# EAGLE design e-stop-radio (EAGLE 9.5.1)

## Sheet 1 of 2
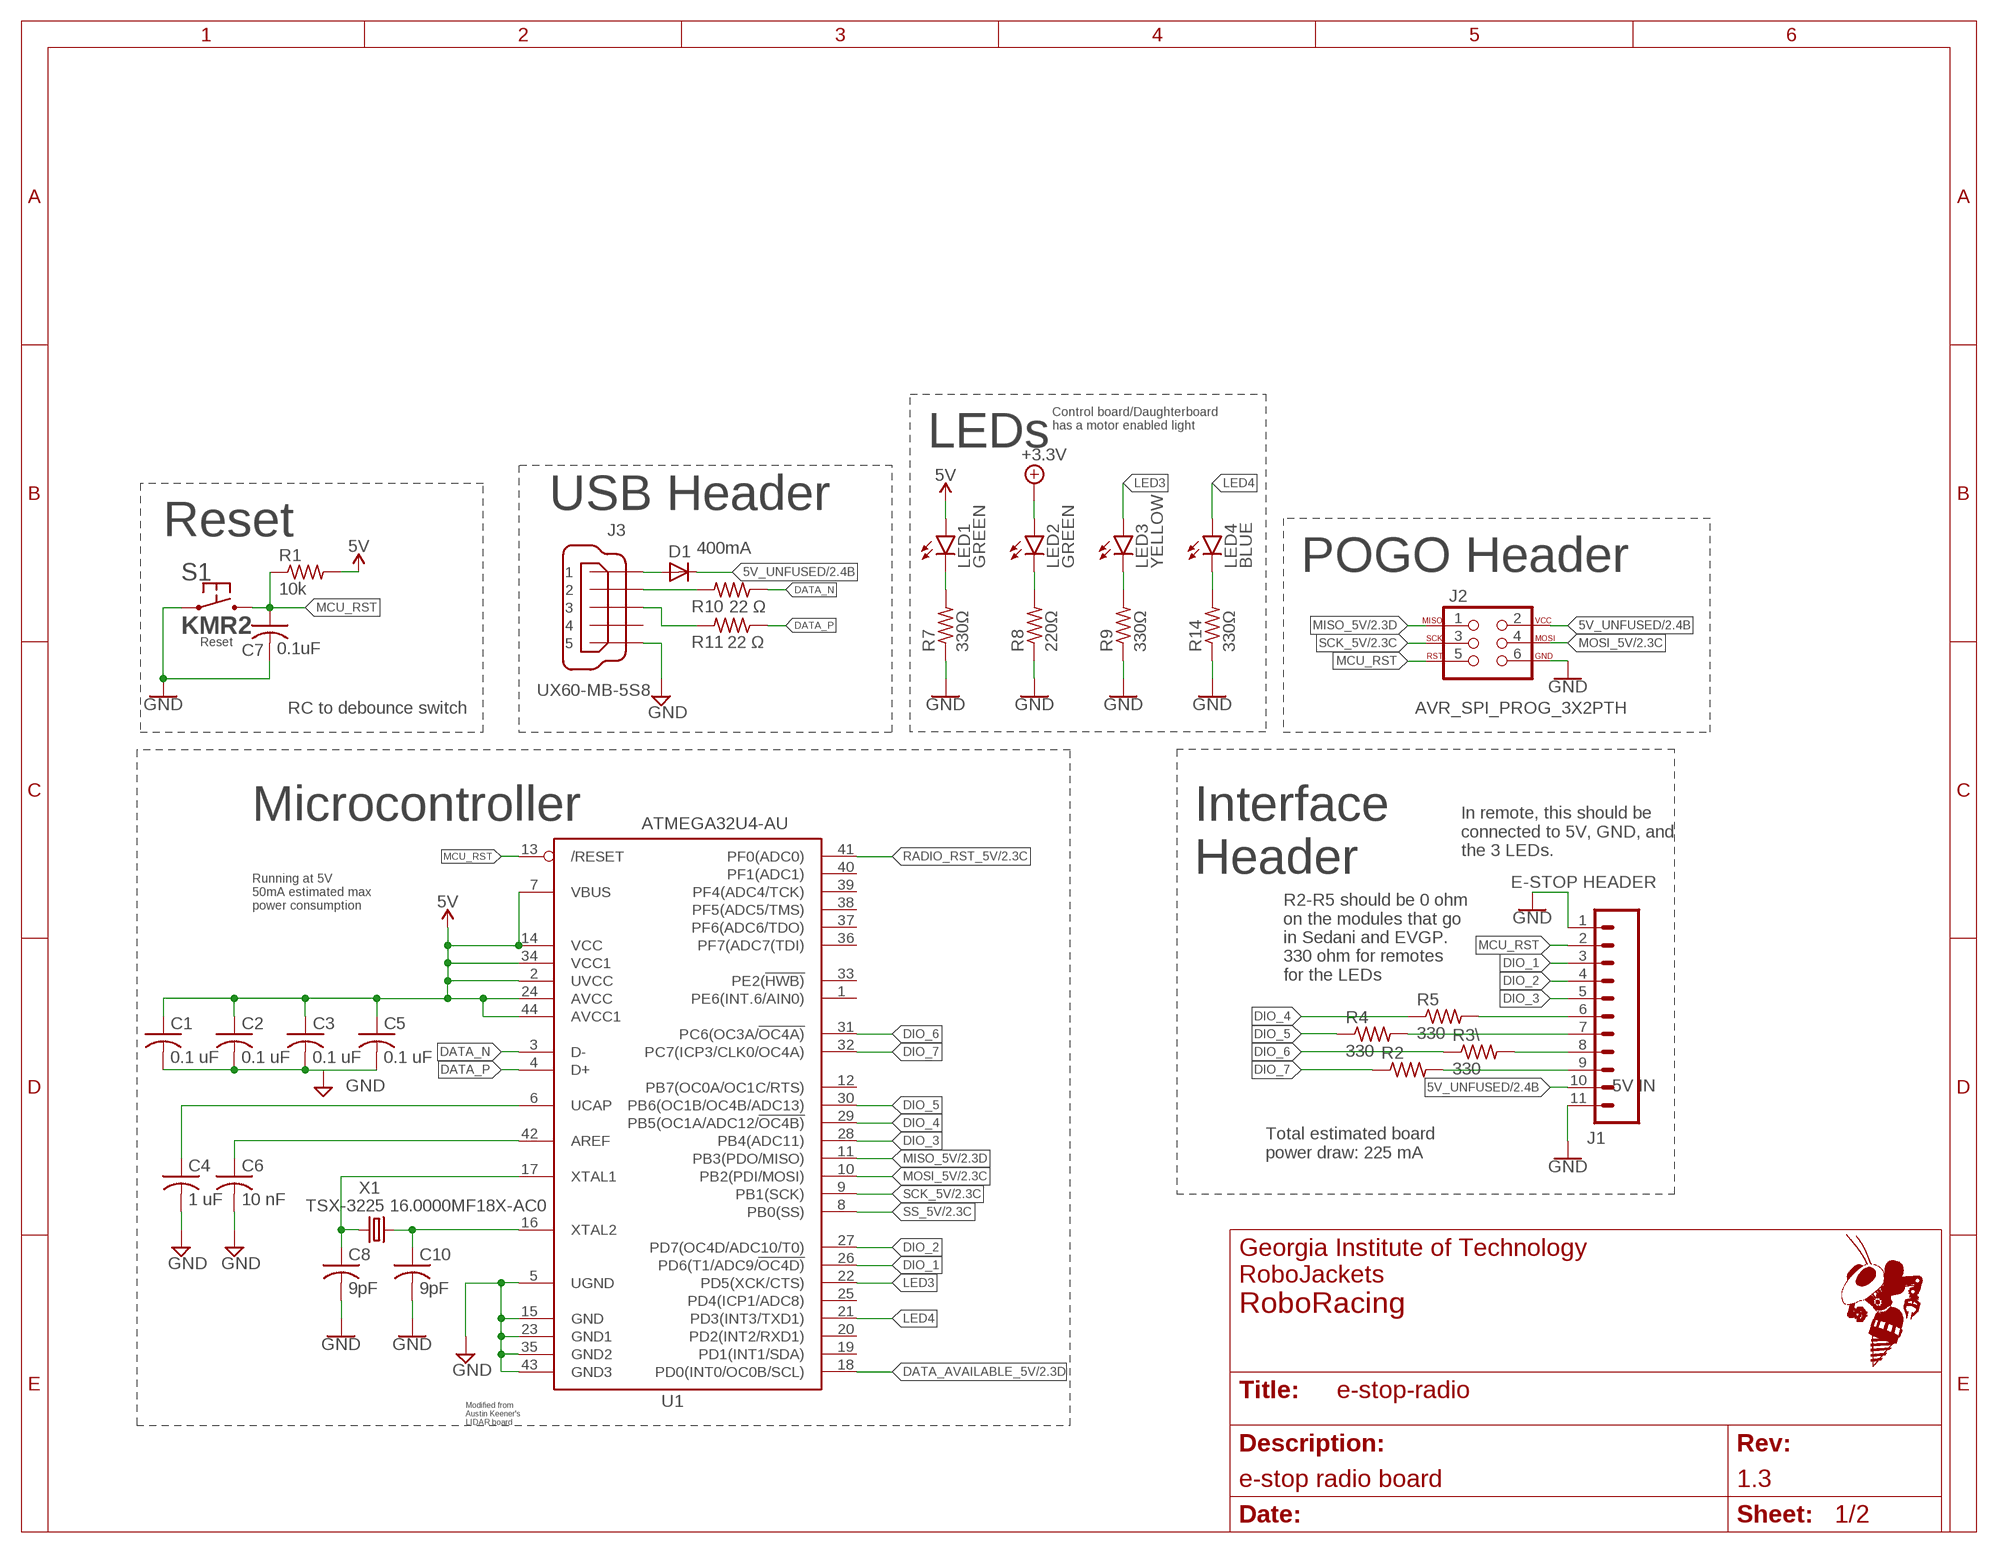
[diagram p0: schematic, sheet 1]
FRAME4 (FRAME_A_L): REVISION: 1.3; SCH_DESC: e-stop radio board; TEAM: RoboRacing

### Parts
C1  0.1 uF  C-USC0603  [C0603]
C2  0.1 uF  C-USC0603  [C0603]
C3  0.1 uF  C-USC0603  [C0603]
C4  1 uF  C-USC0603  [C0603]
C5  0.1 uF  C-USC0603  [C0603]
C6  10 nF  C-USC0603  [C0603]
C7  0.1uF  C-USC0603  [C0603]
C8  9pF  C-USC0603  [C0603]
C10  9pF  C-USC0603  [C0603]
D1  400mA  DIODE-SOD323-R  [SOD323-R]
J1  E-STOP HEADER  CONN_11  [1X11]
J2  AVR_SPI_PROG_3X2PTH  [2X3]
J3  UX60-MB-5S8  [UX60-MB-5S8]
LED1  GREEN  LEDCHIP-LED0603  [CHIP-LED0603]
LED2  GREEN  LEDCHIP-LED0603  [CHIP-LED0603]
LED3  YELLOW  LEDCHIP-LED0603  [CHIP-LED0603]
LED4  BLUE  LEDCHIP-LED0603  [CHIP-LED0603]
R1  10k  R-US_R0603  [R0603]
R2  330  R-US_R0603  [R0603]
R3\  330  R-US_R0603  [R0603]
R4  330  R-US_R0603  [R0603]
R5  330  R-US_R0603  [R0603]
R7  330Ω  R-US_R0603  [R0603]
R8  220Ω  R-US_R0603  [R0603]
R9  330Ω  R-US_R0603  [R0603]
R10  22 Ω  R-US_R0603  [R0603]
R11  22 Ω  R-US_R0603  [R0603]
R14  330Ω  R-US_R0603  [R0603]
S1  KMR2  [KMR2]
U1  ATMEGA32U4-AU  [TQFP44]
X1  TSX-3225 16.0000MF18X-AC0  XTAL-3.2X2.5  [XTAL-3.2X2.5]

### Nets
5V [power]: C1.1 C2.1 C3.1 C5.1 LED1.A R1.2 U1.2(UVCC) U1.7(VBUS) U1.14(VCC) U1.24(AVCC) U1.34(VCC1) U1.44(AVCC1) ; also sheet 2
5V_UNFUSED [power]: D1.C J1.10 J2.2 ; also sheet 2
+3.3V [power]: LED2.A ; also sheet 2
AREF: C6.1 U1.42(AREF)
DATA_AVAILABLE_5V: U1.18(PD0(INT0/OC0B/SCL)) ; also sheet 2
DATA_N [RF]: R10.1 U1.3(D-)
DATA_P [RF]: R11.1 U1.4(D+)
DIO_1: J1.3 U1.26(PD6(T1/ADC9/!OC4D))
DIO_2: J1.4 U1.27(PD7(OC4D/ADC10/T0))
DIO_3: J1.5 U1.28(PB4(ADC11))
DIO_4: R5.1 U1.29(PB5(OC1A/ADC12/!OC4B))
DIO_4_R: J1.6 R5.2
DIO_5: R4.1 U1.30(PB6(OC1B/OC4B/ADC13))
DIO_5_R: J1.7 R4.2
DIO_6: R3\.1 U1.31(PC6(OC3A/!OC4A))
DIO_6_R: J1.8 R3\.2
DIO_7: R2.1 U1.32(PC7(ICP3/CLK0/OC4A))
DIO_7_R: J1.9 R2.2
GND [power]: C1.2 C2.2 C3.2 C4.2 C5.2 C6.2 C7.2 C8.2 C10.2 J1.1 J1.11 J2.6 J3.5 R7.1 R8.1 R9.1 R14.1 S1.1.1 S1.1.2 U1.5(UGND) U1.15(GND) U1.23(GND1) U1.35(GND2) U1.43(GND3) ; also sheet 2
LED3: LED3.A U1.22(PD5(XCK/CTS))
LED4: LED4.A U1.21(PD3(INT3/TXD1))
MCU_RST: C7.1 J1.2 J2.5 R1.1 S1.2.1 S1.2.2 U1.13(/RESET)
MISO_5V: J2.1 U1.11(PB3(PDO/MISO)) ; also sheet 2
MOSI_5V: J2.4 U1.10(PB2(PDI/MOSI)) ; also sheet 2
N$2: LED3.C R9.2
N$3: LED1.C R7.2
N$4: LED2.C R8.2
N$5: J3.2 R10.2
N$6: LED4.C R14.2
N$7: D1.A J3.1
N$11: J3.3 R11.2
RADIO_RST_5V: U1.41(PF0(ADC0)) ; also sheet 2
SCK_5V: J2.3 U1.9(PB1(SCK)) ; also sheet 2
SS_5V: U1.8(PB0(SS)) ; also sheet 2
UCAP: C4.1 U1.6(UCAP)
XTAL1: C8.1 U1.17(XTAL1) X1.1
XTAL2: C10.1 U1.16(XTAL2) X1.3
Unconnected: J3.4 U1.1(PE6(INT.6/AIN0)) U1.12(PB7(OC0A/OC1C/RTS)) U1.19(PD1(INT1/SDA)) U1.20(PD2(INT2/RXD1)) U1.25(PD4(ICP1/ADC8)) U1.33(PE2(!HWB)) U1.36(PF7(ADC7(TDI)) U1.37(PF6(ADC6/TDO)) U1.38(PF5(ADC5/TMS)) U1.39(PF4(ADC4/TCK)) U1.40(PF1(ADC1))

### Notes on the sheet
- Control board/Daughterboard
  has a motor enabled light
- LEDs
- USB Header
- Reset
- POGO Header
- RC to debounce switch
- Microcontroller
- In remote, this should be 
  connected to 5V, GND, and 
  the 3 LEDs.
- Interface
  Header
- Running at 5V
  50mA estimated max
  power consumption
- R2-R5 should be 0 ohm
  on the modules that go
  in Sedani and EVGP.
  330 ohm for remotes
  for the LEDs
- 5V IN
- Total estimated board
  power draw: 225 mA
- Modified from 
  Austin Keener's 
  LIDAR board

## Sheet 2 of 2
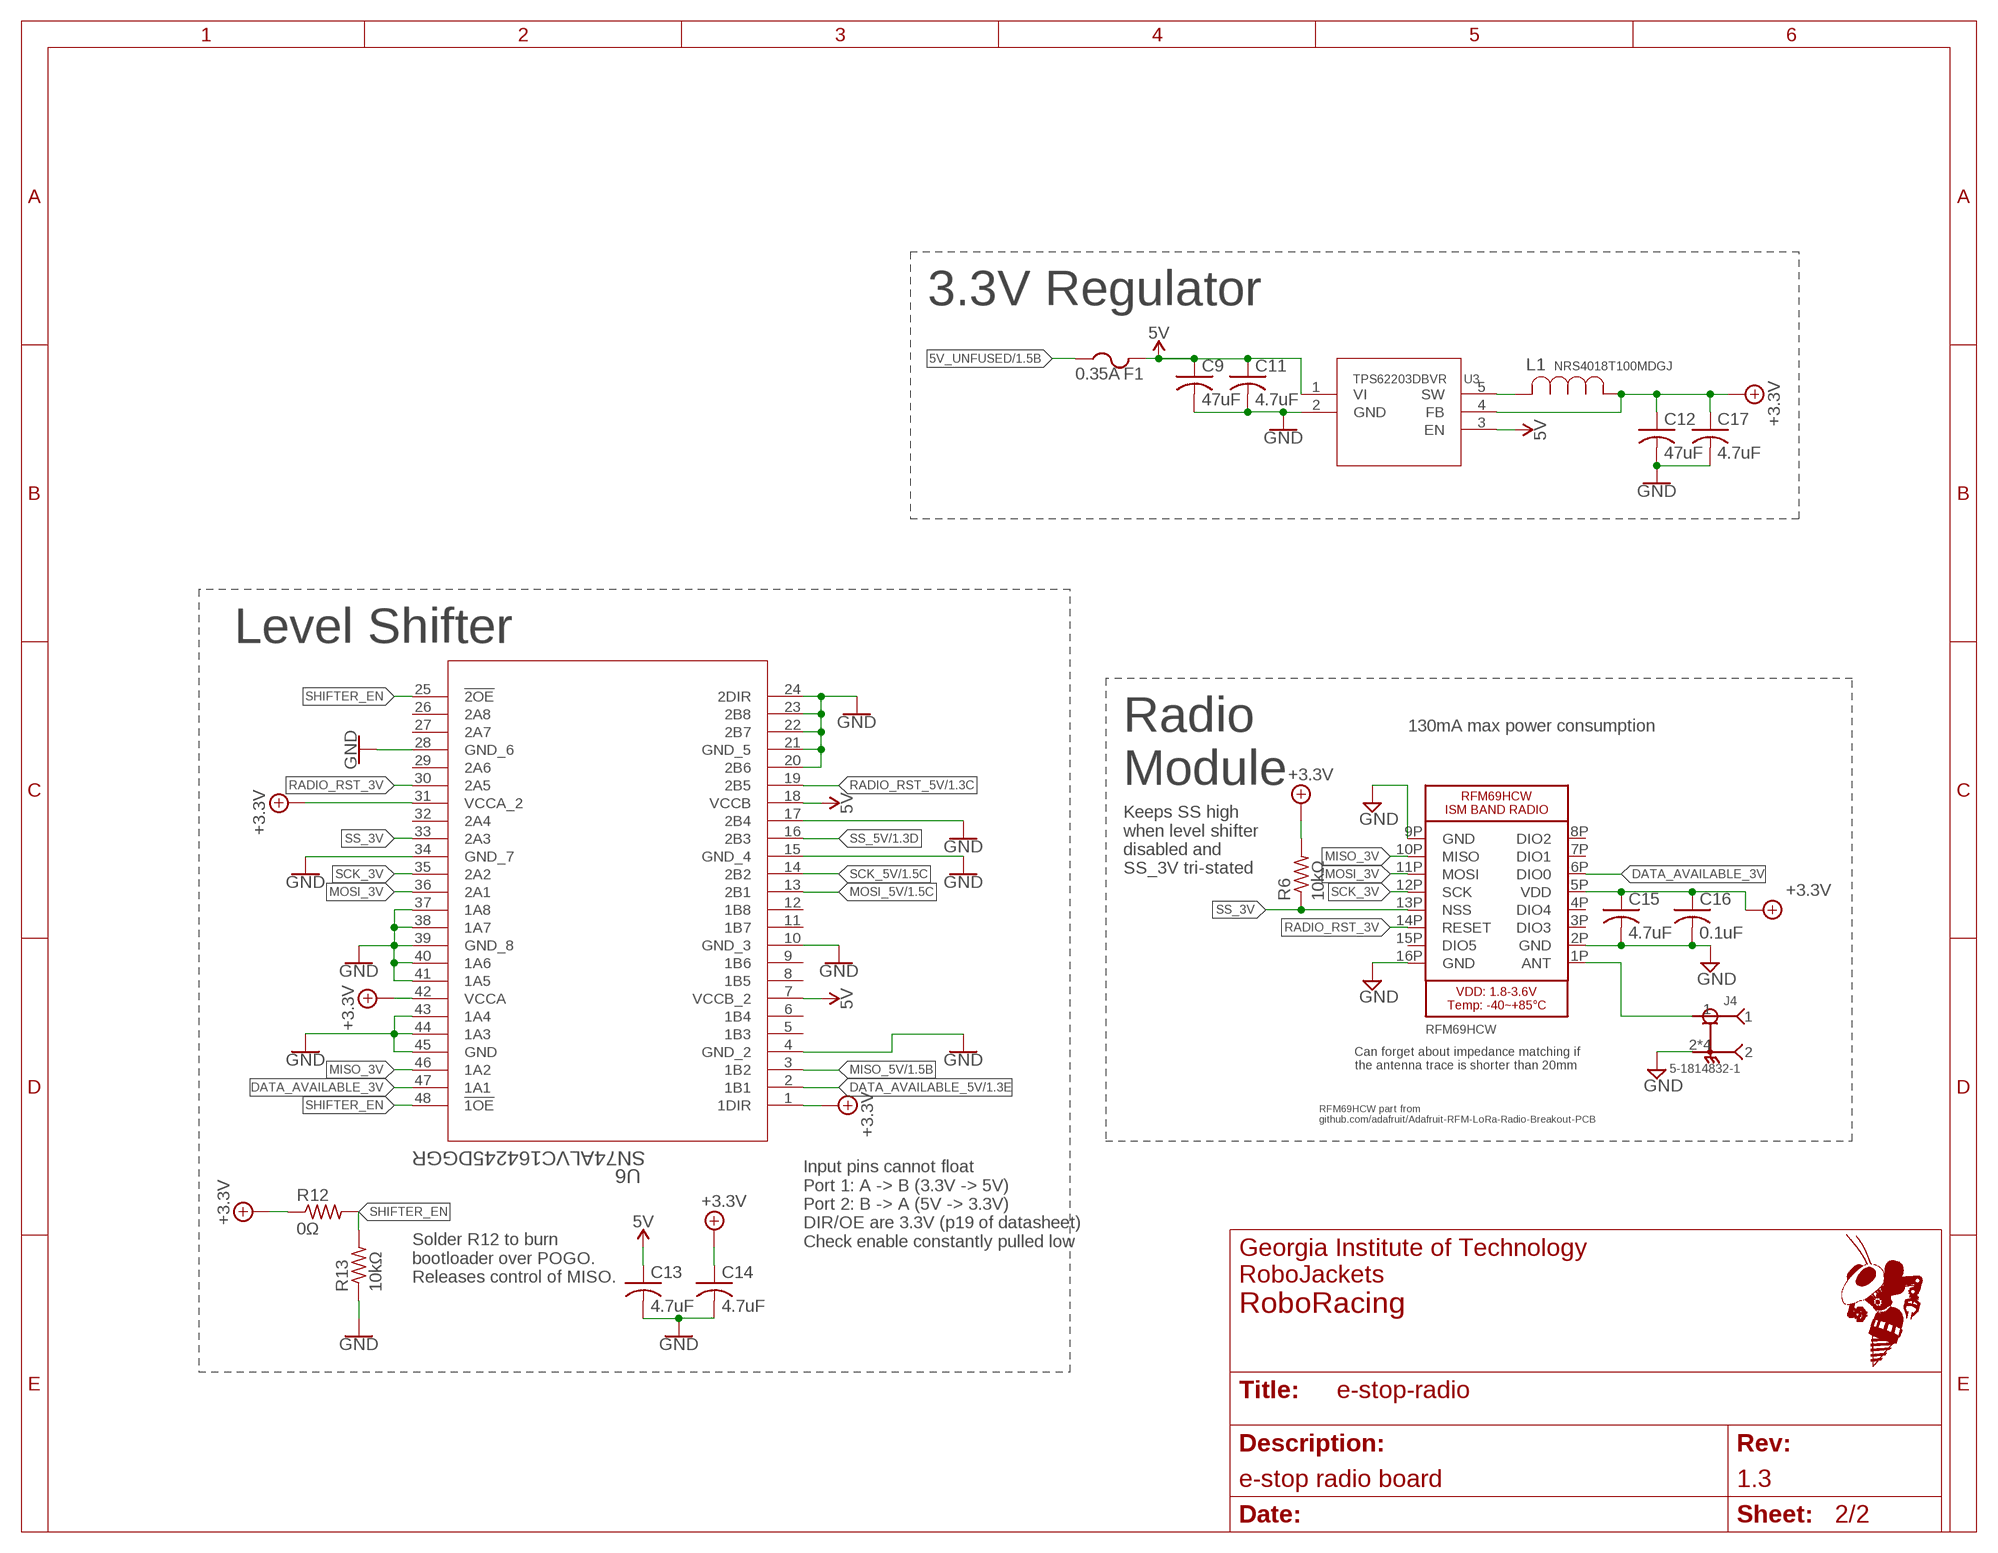
[diagram p1: schematic, sheet 2]
FRAME3 (FRAME_A_L): REVISION: 1.3; SCH_DESC: e-stop radio board; TEAM: RoboRacing

### Parts
C9  47uF  C-USC1206  [C1206]
C11  4.7uF  C-USC0603  [C0603]
C12  47uF  C-USC1206  [C1206]
C13  4.7uF  C-USC0603  [C0603]
C14  4.7uF  C-USC0603  [C0603]
C15  4.7uF  C-USC0603  [C0603]
C16  0.1uF  C-USC0603  [C0603]
C17  4.7uF  C-USC0603  [C0603]
F1  0.35A  PTCFUSE-1206  [R1206]
J4  5-1814832-1  [TE_5-1814832-1]
L1  NRS4018T100MDGJ  [IND_TAIYO_NRS4018]
R6  10kΩ  R-US_R0603  [R0603]
R12  0Ω  R-US_R0603  [R0603]
R13  10kΩ  R-US_R0603  [R0603]
U3  TPS62203DBVR  [DBV5]
U5  RFM69HCW  RFM69HCW_SMT  [RFMHCW_SMT]
U6  SN74ALVC164245DGGR  [DGG48]

### Nets
5V [power]: C9.1 C11.1 C13.1 F1.2 U3.1(VI) U3.3(EN) U6.7(VCCB_2) U6.18(VCCB) ; also sheet 1
5V_UNFUSED [power]: F1.1 ; also sheet 1
+3.3V [power]: C12.1 C14.1 C15.1 C16.1 C17.1 L1.1 R6.2 R12.1 U3.4(FB) U5.5P(VDD) U6.1(1DIR) U6.31(VCCA_2) U6.42(VCCA) ; also sheet 1
DATA_AVAILABLE_3V: U5.6P(DIO0) U6.47(1A1)
DATA_AVAILABLE_5V: U6.2(1B1) ; also sheet 1
GND [power]: C9.2 C11.2 C12.2 C13.2 C14.2 C15.2 C16.2 C17.2 J4.2 J4.3 J4.4 J4.5 R13.1 U3.2(GND) U5.2P(GND) U5.9P(GND) U5.16P(GND) U6.4(GND_2) U6.10(GND_3) U6.15(GND_4) U6.17(2B4) U6.20(2B6) U6.21(GND_5) U6.22(2B7) U6.23(2B8) U6.24(2DIR) U6.28(GND_6) U6.34(GND_7) U6.37(1A8) U6.38(1A7) U6.39(GND_8) U6.40(1A6) U6.41(1A5) U6.43(1A4) U6.44(1A3) U6.45(GND) ; also sheet 1
MISO_3V: U5.10P(MISO) U6.46(1A2)
MISO_5V: U6.3(1B2) ; also sheet 1
MOSI_3V: U5.11P(MOSI) U6.36(2A1)
MOSI_5V: U6.13(2B1) ; also sheet 1
N$1 [power]: L1.2 U3.5(SW)
RADIO_RST_3V: U5.14P(RESET) U6.30(2A5)
RADIO_RST_5V: U6.19(2B5) ; also sheet 1
RF_SIGNAL [RF]: J4.1 U5.1P(ANT)
SCK_3V: U5.12P(SCK) U6.35(2A2)
SCK_5V: U6.14(2B2) ; also sheet 1
SHIFTER_EN: R12.2 R13.2 U6.25(!2OE) U6.48(!1OE)
SS_3V: R6.1 U5.13P(NSS) U6.33(2A3)
SS_5V: U6.16(2B3) ; also sheet 1
Unconnected: U5.3P(DIO3) U5.4P(DIO4) U5.7P(DIO1) U5.8P(DIO2) U5.15P(DIO5) U6.5(1B3) U6.6(1B4) U6.8(1B5) U6.9(1B6) U6.11(1B7) U6.12(1B8) U6.26(2A8) U6.27(2A7) U6.29(2A6) U6.32(2A4)

### Notes on the sheet
- 3.3V Regulator
- Level Shifter
- 130mA max power consumption
- Radio
  Module
- Keeps SS high
  when level shifter
  disabled and
  SS_3V tri-stated
- Can forget about impedance matching if 
  the antenna trace is shorter than 20mm
- RFM69HCW part from
  github.com/adafruit/Adafruit-RFM-LoRa-Radio-Breakout-PCB
- Input pins cannot float
  Port 1: A -> B (3.3V -> 5V)
  Port 2: B -> A (5V -> 3.3V)
  DIR/OE are 3.3V (p19 of datasheet)
  Check enable constantly pulled low
- Solder R12 to burn
  bootloader over POGO.
  Releases control of MISO.

## Library data of the parts
C1-C6 C8 C10 = resistor:C-US: CAPACITOR, American symbol
C7 C9 C11-C17 = rcl:C-US: CAPACITOR, American symbol; SPICEPREFIX: C
D1 = RoboJackets-Diodes:DIODE-: DIODE
F1 = adafruit:PTCFUSE: PTC fuses, resettable thermistors
J1 = SparkFun-Connectors:CONN_11: Multi connection point. Often used as Generic Header-pin footprint for 0.1 inch spaced/style header connections On any of the 0.1 inch spaced packages, you can populate with these: Break Away Headers - Straight <https://www.sparkfun.com/products/116> (PRT-00116) Break Away Male Headers - Right Angle <https://www.sparkfun.com/products/553> (PRT-00553) Female Headers <https://www.sparkfun.com/products/115> (PRT-00115) Break Away Headers - Machine Pin <https://www.sparkfun.com/products/117> (PRT-00117) Break Away Female Headers - Swiss Machine Pin <https://www.sparkfun.com/products/743> (PRT-00743) For SCREWTERMINALS and SPRING TERMINALS visit here: Screw Terimnals on SparkFun.com <https://www.sparkfun.com/search/results?term=Screw+Terminals> (5mm/3.5mm/2.54mm spacing) This device is also useful as a general connection point to wire up your design to another part of your project. Our various solder wires solder well into these plated through hole pads. Hook-Up Wire - Assortment (Stranded, 22 AWG) <https://www.sparkfun.com/products/11375> (PRT-11375) Hook-Up Wire - Assortment (Solid Core, 22 AWG) <https://www.sparkfun.com/products/11367> (PRT-11367) View the entire wire category on our website here <https://www.sparkfun.com/categories/141>
J2 = SparkFun-Connectors:AVR_SPI_PROG_3X2: AVR ISP 6 Pin This is the reduced ISP connector for AVR programming. Common on Arduino. This footprint will take up less PCB space and can be used with a 10-pin to 6-pin adapter such as SKU: BOB-08508 **Special note about "TEST_POINT" package. The stop mask is on the top side, so if you want your programming test points to be on the bottom of your board, make sure to place this package on the bottom side of the board. This also ensure that the orientation to program from the bottom side will be correct. SparkFun Products: SparkFun ISP Pogo Adapter <https://www.sparkfun.com/products/11591> - NS Tiny AVR Programmer <https://www.sparkfun.com/products/11801> -PTH
J3 = RoboJackets-Connectors:UX60*-MB-5S?: Mini USB Connector Brand: Hirose Electric Co Ltd <http://www.hirose.com/us/> Series: UX <http://www.digikey.com/product-search/en?FV=fff40016,fff802e4,ffec3225> Distributor: Digi-Key <http://www.digikey.com/product-detail/en/UX60A-MB-5ST/H2961CT-ND/597540>; PINS: 5
J4 = estop-v1.0:5-1814832-1: SMA Str PCB Skt GZD; COMMENT: 5-1814832-1; DESCRIPTION: SMA Str PCB Skt GZD; DIGI-KEY_PART_NUMBER: A97594-ND; DIGI-KEY_PURCHASE_URL: https://www.digikey.com/product-detail/en/te-connectivity-amp-connectors/5-1814832-1/A97594-ND/1755982?utm_source=snapeda&utm_medium=aggregator&utm_campaign=symbol; EU_ROHS_COMPLIANCE: Compliant with Exemptions; MF: TE Connectivity; MP: 5-1814832-1; NUMBER_OF_POSITIONS: 1; PACKAGE: None; TE_PURCHASE_URL: https://www.te.com/usa-en/product-5-1814832-1.html?te_bu=Cor&te_type=disp&te_campaign=seda_glo_cor-seda-global-disp-prtnr-fy19-seda-model-bom-cta_sma-317_1&elqCampaignId=32493
L1 = estop-v1.0:NRS4018T100MDGJ; MANUFACTURER_PART_NUMBER: NRS4018T100MDGJ; VENDOR: TAIYO YUDEN
LED1-LED4 = led:LED: LED OSRAM: - CHIPLED LG R971, LG N971, LY N971, LG Q971, LY Q971, LO R971, LY R971 LH N974, LH R974 LS Q976, LO Q976, LY Q976 LO Q996 - Hyper CHIPLED LW Q18S LB Q993, LB Q99A, LB R99A - SideLED LS A670, LO A670, LY A670, LG A670, LP A670 LB A673, LV A673, LT A673, LW A673 LH A674 LY A675 LS A676, LA A676, LO A676, LY A676, LW A676 LS A679, LY A679, LG A679 - Hyper Micro SIDELED® LS Y876, LA Y876, LO Y876, LY Y876 LT Y87S - SmartLED LW L88C, LW L88S LB L89C, LB L89S, LG L890 LS L89K, LO L89K, LY L89K LS L896, LA L896, LO L896, LY L896 - TOPLED LS T670, LO T670, LY T670, LG T670, LP T670 LSG T670, LSP T670, LSY T670, LOP T670, LYG T670 LG T671, LOG T671, LSG T671 LB T673, LV T673, LT T673, LW T673 LH T674 LS T676, LA T676, LO T676, LY T676, LB T676, LH T676, LSB T676, LW T676 LB T67C, LV T67C, LT T67C, LS T67K, LO T67K, LY T67K, LW E67C LS E67B, LA E67B, LO E67B, LY E67B, LB E67C, LV E67C, LT E67C LW T67C LS T679, LY T679, LG T679 LS T770, LO T770, LY T770, LG T770, LP T770 LB T773, LV T773, LT T773, LW T773 LH T774 LS E675, LA E675, LY E675, LS T675 LS T776, LA T776, LO T776, LY T776, LB T776 LHGB T686 LT T68C, LB T68C - Hyper Mini TOPLED® LB M676 - Mini TOPLED Santana® LG M470 LS M47K, LO M47K, LY M47K Source: http://www.osram.convergy.de LUXEON: - LUMILED® LXK2-PW12-R00, LXK2-PW12-S00, LXK2-PW14-U00, LXK2-PW14-V00 LXK2-PM12-R00, LXK2-PM12-S00, LXK2-PM14-U00 LXK2-PE12-Q00, LXK2-PE12-R00, LXK2-PE12-S00, LXK2-PE14-T00, LXK2-PE14-U00 LXK2-PB12-K00, LXK2-PB12-L00, LXK2-PB12-M00, LXK2-PB14-N00, LXK2-PB14-P00, LXK2-PB14-Q00 LXK2-PR12-L00, LXK2-PR12-M00, LXK2-PR14-Q00, LXK2-PR14-R00 LXK2-PD12-Q00, LXK2-PD12-R00, LXK2-PD12-S00 LXK2-PH12-R00, LXK2-PH12-S00 LXK2-PL12-P00, LXK2-PL12-Q00, LXK2-PL12-R00 Source: www.luxeon.com KINGBRIGHT: KA-3528ASYC Source: www.kingbright.com
R1 R2 R3\ R4-R14 = rcl:R-US_: RESISTOR, American symbol; SPICEPREFIX: R
S1 = RoboJackets-Switches:KMR2; FUNCTION: Reset
U1 = estop-v1.0:ATMEGA32U4: http://www.ladyada.net/library/eagle
U3 = estop-v1.0:TPS62203DBVR; MANUFACTURER_PART_NUMBER: TPS62203DBVR; VENDOR: Texas Instruments
U5 = estop-v1.0:RFM69HCW: RFM69HCW - ISM Band RF Transceiver
U6 = estop-v1.0:SN74ALVC164245DGGR; MANUFACTURER_PART_NUMBER: SN74ALVC164245DGGR; VENDOR: Texas Instruments
X1 = RoboJackets-FreqGen:XTAL

## Net classes
0 default: width 0.203 mm, drill 0.508 mm, clearance 0.178 mm
1 power: width 0.305 mm, drill 0.508 mm, clearance 0.178 mm
2 RF: width 0.203 mm, clearance 0.178 mm

## Board
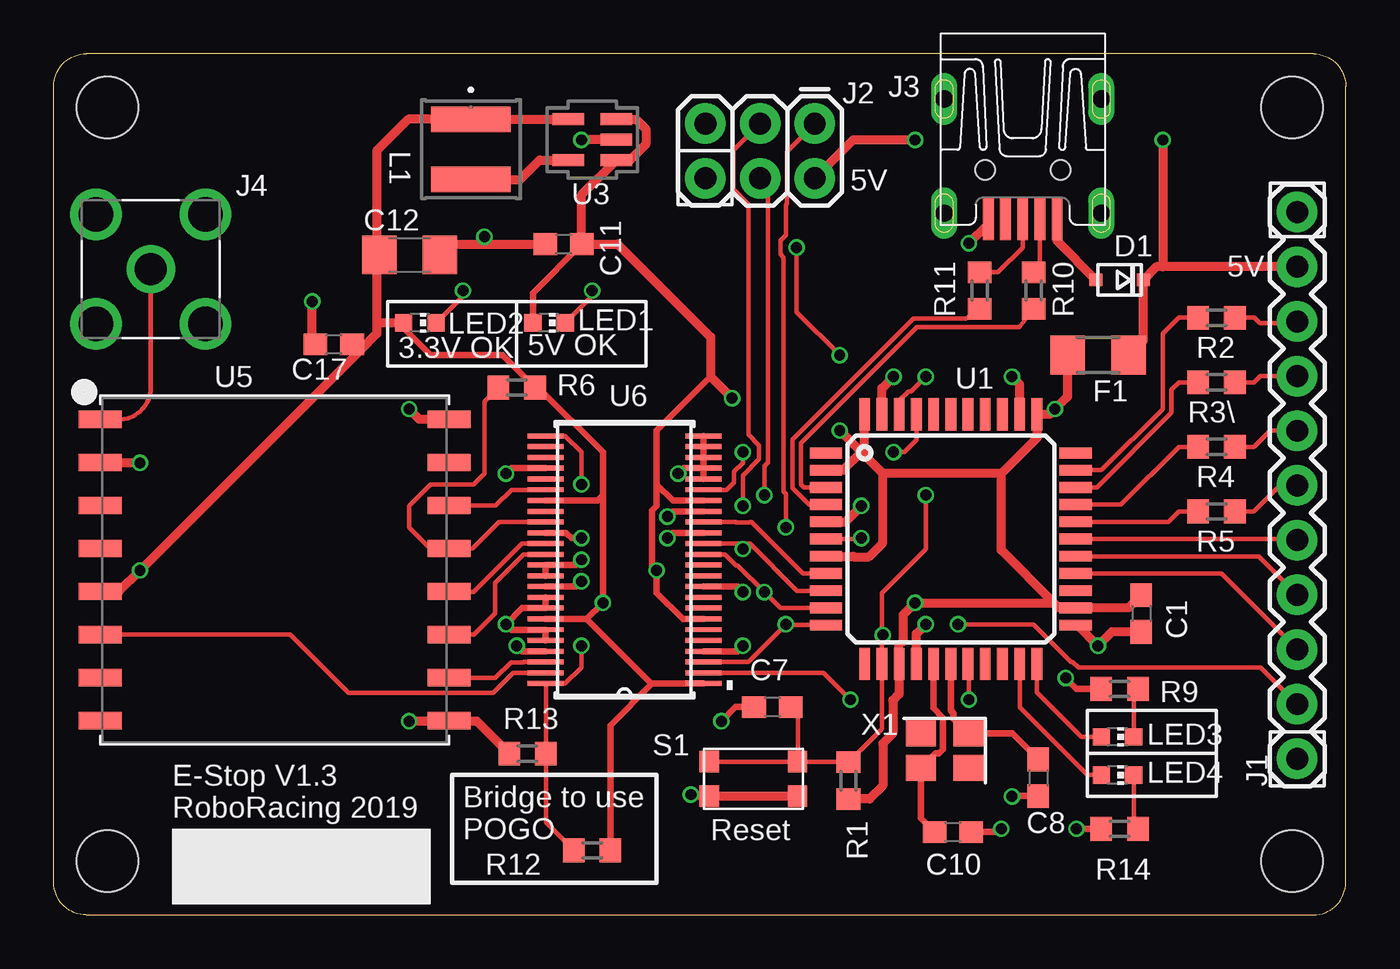
[diagram p2: board, top side]
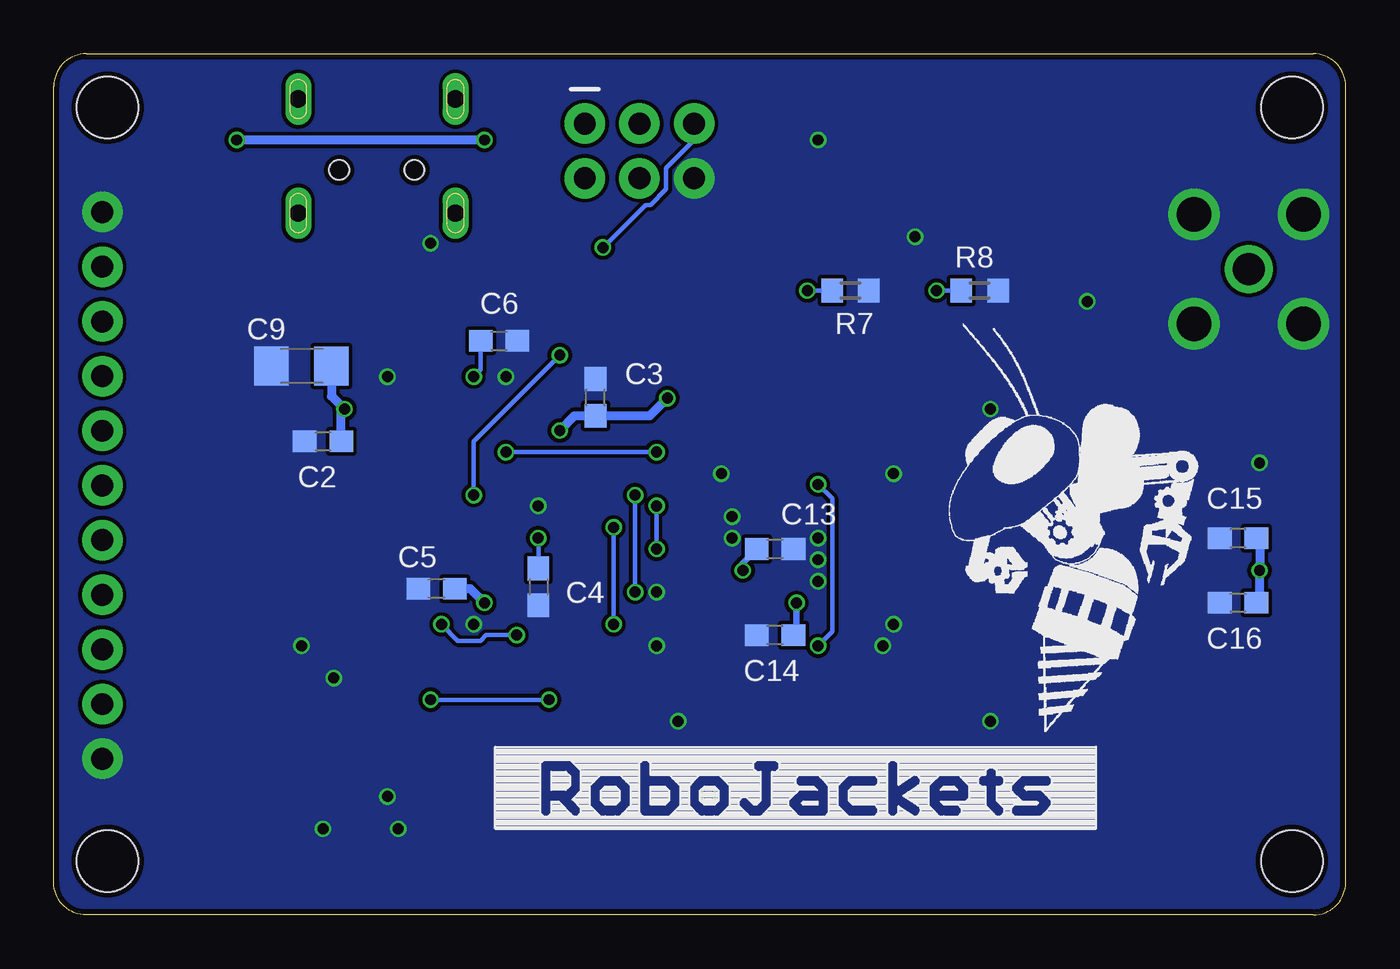
[diagram p3: board, bottom side, seen from below]

Size 60 x 40 mm. Coordinates in mm from the lower left corner, seen from the top.
Outline: 1.5,0 58.5,0 arc90 60,1.5 60,38.5 arc90 58.5,40 1.5,40 arc90 0,38.5 0,1.5 arc90 1.5,0
Copper layers (1*16): Top 0.018mm / dielectric 1.55mm / Bottom 0.018mm
Design rules "eC_2Layer_PClass6_BaseCopperO18_eCDefault": minimum track width 0.15mm, minimum drill 0.35mm, track to track 0.15mm, track to pad 0.15mm, pad to pad 0.15mm, via to via 0.15mm, smd to smd 0mil, copper to edge 0.25mm, drill to drill 0.35mm, minimum pad ring 0.175mm, minimum via ring 0.125mm, stop-mask expansion 0mil, vias tented up to drill 0.45mm, thermal gap 0.2mm
Holes 2.85 mm at 2.5,2.5 57.5,37.5 57.5,2.5 2.5,37.5

### Footprints (pad centres in the part's own frame; a part is rotated, then mirrored left to right if it is on the bottom)
C0603 = smd 1.1 x 1: 1 -0.85,0; 2 0.85,0
C1206 = smd 1.6 x 1.8: 1 -1.4,0; 2 1.4,0
SOD323-R = smd 0.6 x 0.6: A 1.1,0; C -1.1,0
R1206 = smd 1.6 x 1.803: 1 -1.422,0; 2 1.422,0
1X11 = drill 1.016 pad 1.88: 1 0,0; 2 2.54,0; 3 5.08,0; 4 7.62,0; 5 10.16,0; 6 12.7,0; 7 15.24,0; 8 17.78,0; 9 20.32,0; 10 22.86,0; 11 25.4,0
2X3 = drill 1.016 pad 1.88: 1 0,0; 2 0,2.54; 3 2.54,0; 4 2.54,2.54; 5 5.08,0; 6 5.08,2.54
UX60-MB-5S8 = smd 2 x 0.5: 1 8.65,1.6; 2 8.65,0.8; 3 8.65,0; 4 8.65,-0.8; 5 8.65,-1.6 | drill 0.8 long: M1 3.1,-3.65; M2 3.1,3.65; M3 8.4,3.65; M4 8.4,-3.65 | hole 0.9: 6.4,-1.75; 6.4,1.75
TE_5-1814832-1 = drill 1.5: 1 0,0 | drill 1.6: 2 -2.54,2.54; 3 2.54,2.54; 4 -2.54,-2.54; 5 2.54,-2.54
IND_TAIYO_NRS4018 = smd 1.194 x 3.708: 1 -1.397,0; 2 1.397,0
CHIP-LED0603 = smd 0.8 x 0.8: A 0,-0.75; C 0,0.75
R0603 = smd 1 x 1.1: 1 -0.85,0; 2 0.85,0
KMR2 = smd 0.9 x 1: 1.1 -2.05,0.8; 1.2 2.05,0.8; 2.1 -2.05,-0.8; 2.2 2.05,-0.8
TQFP44 = smd 1.5 x 0.5: 1 -5.8,4; 2 -5.8,3.2; 3 -5.8,2.4; 4 -5.8,1.6; 5 -5.8,0.8; 6 -5.8,0; 7 -5.8,-0.8; 8 -5.8,-1.6; 9 -5.8,-2.4; 10 -5.8,-3.2; 11 -5.8,-4; 23 5.8,-4; 24 5.8,-3.2; 25 5.8,-2.4; 26 5.8,-1.6; 27 5.8,-0.8; 28 5.8,0; 29 5.8,0.8; 30 5.8,1.6; 31 5.8,2.4; 32 5.8,3.2; 33 5.8,4 | smd 0.5 x 1.5: 12 -4,-5.8; 13 -3.2,-5.8; 14 -2.4,-5.8; 15 -1.6,-5.8; 16 -0.8,-5.8; 17 0,-5.8; 18 0.8,-5.8; 19 1.6,-5.8; 20 2.4,-5.8; 21 3.2,-5.8; 22 4,-5.8; 34 4,5.8; 35 3.2,5.8; 36 2.4,5.8; 37 1.6,5.8; 38 0.8,5.8; 39 0,5.8; 40 -0.8,5.8; 41 -1.6,5.8; 42 -2.4,5.8; 43 -3.2,5.8; 44 -4,5.8
DBV5 = smd 1.473 x 0.559: 1 -1.118,0.95; 2 -1.118,0; 3 -1.118,-0.95; 4 1.118,-0.95; 5 1.118,0.95
RFMHCW_SMT = smd 2 x 0.8: 1P 8.1,-7; 2P 8.1,-5; 3P 8.1,-3; 4P 8.1,-1; 5P 8.1,1; 6P 8.1,3; 7P 8.1,5; 8P 8.1,7; 9P -8.1,7; 10P -8.1,5; 11P -8.1,3; 12P -8.1,1; 13P -8.1,-1; 14P -8.1,-3; 15P -8.1,-5; 16P -8.1,-7
DGG48 = smd 1.676 x 0.229: 1 -3.67,5.75; 2 -3.67,5.25; 3 -3.67,4.75; 4 -3.67,4.25; 5 -3.67,3.75; 6 -3.67,3.25; 7 -3.67,2.75; 8 -3.67,2.25; 9 -3.67,1.75; 10 -3.67,1.25; 11 -3.67,0.75; 12 -3.67,0.25; 13 -3.67,-0.25; 14 -3.67,-0.75; 15 -3.67,-1.25; 16 -3.67,-1.75; 17 -3.67,-2.25; 18 -3.67,-2.75; 19 -3.67,-3.25; 20 -3.67,-3.75; 21 -3.67,-4.25; 22 -3.67,-4.75; 23 -3.67,-5.25; 24 -3.67,-5.75; 25 3.67,-5.75; 26 3.67,-5.25; 27 3.67,-4.75; 28 3.67,-4.25; 29 3.67,-3.75; 30 3.67,-3.25; 31 3.67,-2.75; 32 3.67,-2.25; 33 3.67,-1.75; 34 3.67,-1.25; 35 3.67,-0.75; 36 3.67,-0.25; 37 3.67,0.25; 38 3.67,0.75; 39 3.67,1.25; 40 3.67,1.75; 41 3.67,2.25; 42 3.67,2.75; 43 3.67,3.25; 44 3.67,3.75; 45 3.67,4.25; 46 3.67,4.75; 47 3.67,5.25; 48 3.67,5.75
XTAL-3.2X2.5 = smd 1.4 x 1.2: 1 -1.1,-0.8; 2 1.1,-0.8; 3 1.1,0.8; 4 -1.1,0.8

### Placement (x,y rotation side)
C1  50.5,14 270 top
C2  47.5,22 180 bottom
C3  34.84,24.04 90 bottom
C4  37.49,15.24 270 bottom
C5  42.22,15.16 180 bottom
C6  39.32,26.66 0 bottom
C7  33.37,9.66 180 top
C8  45.72,6.37 270 top
C9  48.5,25.5 180 bottom
C10  41.75,3.85 0 top
C11  23.67,31.16 180 top
C12  16.52,30.66 0 top
C13  26.5,17 0 bottom
C14  26.5,13 180 bottom
C15  5,17.5 180 bottom
C16  5,14.5 180 bottom
C17  13,26.5 180 top
D1  49.5,29.5 180 top
F1  48.5,26 180 top
J1  57.75,7.25 90 top
J2  35.34,36.76 180 top
J3  45,41 270 top
J4  4.5,30 0 top
L1  19.37,35.56 270 top
LED1  23,27.5 270 top
LED2  17,27.5 270 top
LED3  49.4,8.27 270 top
LED4  49.4,6.5 270 top
R1  36.91,6.24 270 top
R2  54,27.74 0 top
R3\  54,24.74 0 top
R4  54,21.74 0 top
R5  54,18.74 0 top
R6  21.5,24.5 0 top
R7  23,29 180 bottom
R8  17,29 180 bottom
R9  49.5,10.5 0 top
R10  45.5,29 90 top
R11  43,29 90 top
R12  25,3 180 top
R13  22,7.5 0 top
R14  49.5,4 0 top
S1  32.49,6.32 180 top
U1  41.66,17.46 0 top
U3  25.01,36.01 180 top
U5  10.25,16.02 180 top
U6  26.5,16.5 180 top
U$1  [ROBOBUZZ_1.0X]  14,8.5 0 bottom
U$2  [ROBOJACKETS]  39.5,4 0 bottom
X1  41.37,7.63 180 top

### Tracks (layer width: path | path; a pad name or v marks a point on that pad's centre or on a via)
5V  (via drill 0.51)
  Top 0.305: 30.5,25 28,22.5 28,20 | U6.7 29.21,13.75 28,14.96 v28,16 27.79,16.21 27.79,18.8 28,19.01 28,20 | U6.18 28.75,19.25 28,20 | C11.1 22.25,28.89 LED1.A
  Top 0.406: U3.3 27.04,36.96 27.5,36.5 27.5,35.79 26.77,35.06 U3.1 24.52,33.45 C11.1 26.19,31.16 30.5,26.85 30.5,25 v31.5,24 | U1.2 36.66,20.66 37.5,21.5 | U1.44 37.66,21.66 37.5,21.5 | 38.5,20.5 37.5,21.5 | 44,20.5 45.66,22.16 U1.34 46.26,23.26 v46.5,23.5 47.08,24.08 F1.2 | 44,20.5 38.5,20.5 | 44,20.5 44,16.95 46.45,14.5 | 46.45,14.5 46.69,14.26 U1.24 49.91,14.26 C1.1 | 46.45,14.5 v40,14.5 39.45,13.95 39.45,12.73 39.26,12.54 U1.14 39.26,10.26 38.97,9.97 38.97,8.43 38.5,7.96 38.5,6 37.89,5.39 R1.2 | U1.7 37.12,16.66 37.14,16.64 37.86,16.64 38.5,17.28 38.5,20.5 | 37.5,21.5 v36.5,22.5
  Bottom 0.305: C13.1 28,16.35 v28,16
  Bottom 0.406: C2.1 46.65,23.35 v46.5,23.5 47.1,24.1 C9.1 | C5.1 40.66,15.16 v40,14.5 | v36.5,22.5 35.81,23.19 C3.1 32.31,23.19 v31.5,24
5V_UNFUSED  (via drill 0.51)
  Top 0.406: J1.10 51.5,30.11 | 51.5,30.11 51.21,30.11 D1.C 50.6,26.68 F1.1 | v51.5,36 51.5,30.11 | v40,36 37.12,36 J2.2
  Bottom 0.406: v40,36 v51.5,36
+3.3V  (via drill 0.51)
  Top 0.305: U6.42 24.75,13.75 | 24.75,13.75 27.77,10.73 | U6.1 27.79,10.75 27.77,10.73 | 24.75,13.75 v25.5,14.5 25.5,19.5 | R12.1 25.85,8.81 27.77,10.73 | 25.5,19.5 25.5,21.5 22.5,24.5 R6.2 20.85,26 17.5,26 16.25,27.25 LED2.A | 25.5,19.5 25.25,19.25 U6.31
  Top 0.406: U3.4 L1.1 16.46,36.96 15,35.5 15,30.54 | 15,30.54 15,27.5 | 15,27.5 15,27 14.25,26.25 | 14.25,26.25 v4,16 3.02,15.02 U5.5P | C12.1 15,30.54 | LED2.A 15,27.5 | C17.1 14.1,26.25 14.25,26.25
  Bottom 0.305: C14.1 25.5,13.19 v25.5,14.5
  Bottom 0.406: C15.1 4,17.35 v4,16 4,14.65 C16.1
AREF  (via drill 0.51)
  Top 0.203: v40.5,25 39.81,24.32 39.68,24.32 39.26,23.89 U1.42
  Bottom 0.203: C6.1 40.17,25.33 v40.5,25
DATA_AVAILABLE_3V
  Top 0.203: U6.47 21.32,11.25 20.39,10.31 13.69,10.31 10.98,13.02 U5.6P
DATA_AVAILABLE_5V  (via drill 0.51)
  Top 0.203: U1.18 42.5,11.62 v42.5,10 | U6.2 35.75,11.25 v37,10
  Bottom 0.203: v37,10 v42.5,10
DATA_N
  Top 0.203: R10.1 44.85,27.3 40.08,27.3 34.7,21.92 34.7,20 34.84,19.86 U1.3
DATA_P
  Top 0.203: R11.1 42.35,27.7 39.92,27.7 34.3,22.08 34.3,19.83 35.07,19.06 U1.4
DIO_1
  Top 0.203: J1.3 54.22,15.86 U1.26
DIO_2
  Top 0.203: J1.4 55.96,16.66 U1.27
DIO_3
  Top 0.203: J1.5 57.7,17.46 U1.28
DIO_4
  Top 0.203: R5.1 52.24,18.74 51.76,18.26 U1.29
DIO_4_R
  Top 0.203: R5.2 55.74,18.74 56.95,19.95 J1.6
DIO_5
  Top 0.203: R4.1 52.24,21.74 49.56,19.06 U1.30
DIO_5_R
  Top 0.203: R4.2 55.74,21.74 56.49,22.49 J1.7
DIO_6
  Top 0.203: R3\.1 52.24,24.74 51.91,24.41 51.91,23.33 48.44,19.86 U1.31
DIO_6_R
  Top 0.203: R3\.2 55.74,24.74 56.03,25.03 J1.8
DIO_7
  Top 0.203: R2.1 52.24,27.74 51.5,27 51.5,23.5 48.66,20.66 U1.32
DIO_7_R
  Top 0.203: R2.2 55.76,27.74 56,27.5 57.68,27.5 J1.9
GND  (via drill 0.51)
  Top 0.305: C10.2 43.85,3.85 v44,4 | C8.2 44.52,5.52 v44.5,5.5 | R14.1 v47.5,4 | U6.28 21.25,20.75 v21,20.5 | v32,12.5 31.75,12.25 U6.4 | U6.10 31.75,15.25 v32,15 | U6.45 21.75,12.25 v21.5,12.5 | U6.34 23.75,17.75 23.78,17.72 23.82,17.72 24.04,17.5 v24.5,17.5 | R9.1 47.5,10.5 v47,11 | C7.2 31.66,9.66 v31,9 | v24.5,15.5 24.25,15.25 U6.39 | v29,20.5 29.25,20.75 U6.21 | U6.17 28.75,18.75 v28.5,18.5 | U6.15 28.75,17.75 v28.5,17.5 | U6.24 U6.23 U6.22 U6.21 | U6.21 U6.20 | U6.44 U6.43 21.25,13.25 v21,13.5 21.75,14.25 U6.41 U6.40 | U6.38 U6.37 24.25,16.25 v24.5,16.5
  Top 0.406: C12.2 18.42,31.16 20,31.16 | 20,31.16 C11.2 | S1.1.1 S1.1.2 29.66,5.52 v29.59,5.59 | C1.2 49.15,13.15 v48.5,12.5 47.54,13.46 U1.23 | U1.15 40.06,13.06 v40.5,13.5 | v20,31.5 20,31.16 | U5.9P 18.33,9 | 18.33,9 v16.5,9 | U1.35 44.86,24.64 v44.5,25 | U5.16P 16.98,23.02 v16.5,23.5 | U5.2P 3.98,21.02 v4,21 | U1.5 36.76,18.26 v37.5,19 | U1.43 38.46,24.46 v39,25 | U3.2 v24.51,36.01 v24.5,36 | J3.5 43.4,32.1 v42.5,31.2 | R13.1 19.65,9 18.33,9 | C17.2 12,26.65 v12,28.5
  pour Bottom (no thermals): 0,38.5 0,1.5 arc90 1.5,0 58.5,0 arc90 60,1.5 60,38.5 arc90 58.5,40 1.5,40 arc90
LED3
  Top 0.203: U1.22 45.66,10.34 47.73,8.27 LED3.A
LED4
  Top 0.203: LED4.A 48,6.5 44.86,9.64 U1.21
MCU_RST  (via drill 0.51)
  Top 0.203: v36.5,26 34.5,28 v34.5,31 | S1.2.1 34.57,7.09 34.57,9.31 C7.1 | S1.2.1 S1.2.2 | v40.5,19.5 40.5,17 38.46,14.96 38.46,13 | 38.46,13 U1.13 38.46,8.64 R1.1 36.88,7.12 S1.2.1 | J1.2 56.04,11.5 47.58,11.5 47.32,11.76 47.24,11.76 45.5,13.5 v42,13.5 | v38.5,13 38.46,13
  Bottom 0.203: v34.5,31 32.52,32.98 32.28,32.98 31.55,33.7 31.55,34.69 30.26,35.98 J2.5 | v36.5,26 40.5,22 v40.5,19.5 | v38.5,13 39.92,13 40.18,12.74 41.24,12.74 v42,13.5
MISO_3V
  Top 0.203: U5.10P 18.37,11 20.5,11 21.24,11.74 21.82,11.74 21.83,11.75 U6.46
MISO_5V  (via drill 0.51)
  Top 0.203: U1.11 34.04,13.46 v34,13.5 32.26,11.76 31.68,11.76 31.67,11.75 U6.3 | J2.1 34.05,35.47 34.05,33.05 34,33 34,31.58 33.74,31.32 33.74,30.68 33.89,30.53 33.89,19.66 34,19.55 v34,18
  Bottom 0.203: v34,13.5 v34,18
MOSI_3V
  Top 0.203: U6.36 21.82,16.75 20.5,15.43 20.5,14 19.5,13 19.48,13.02 U5.11P
MOSI_5V  (via drill 0.51)
  Top 0.203: U1.10 34.32,14.26 33.74,14.26 v33,15 31.76,16.24 31.68,16.24 31.17,16.75 U6.13 | v33,19.5 33,20.85 33.17,21.02 33.17,33.85 J2.4
  Bottom 0.203: v33,15 v33,19.5
N$1
  Top 0.406: L1.2 21.66,34.16 22.56,35.06 U3.5
N$2
  Top 0.203: LED3.C 50.15,10.3 R9.2
N$3  (via drill 0.51)
  Top 0.203: LED1.C 25,28.75 v25,29
  Bottom 0.203: R7.2 v25,29
N$4  (via drill 0.51)
  Top 0.203: LED2.C 19,28.75 v19,29
  Bottom 0.203: R8.2 v19,29
N$5
  Top 0.203: J3.2 45.8,30.15 R10.2
N$6
  Top 0.203: LED4.C 50.15,4.2 R14.2
N$7
  Top 0.406: J3.1 46.6,31.3 D1.A
N$11
  Top 0.203: J3.3 45,31 43.85,29.85 R11.2
RADIO_RST_3V
  Top 0.203: U6.30 21.25,19.75 20.52,19.02 U5.14P
RADIO_RST_5V  (via drill 0.51)
  Top 0.203: U1.41 40.06,22.06 39.5,21.5 v39,21.5 | U6.19 31.25,19.75 31.59,20.09 31.59,20.59 32,21 v32,21.5
  Bottom 0.203: v32,21.5 v39,21.5
RF_SIGNAL
  Top 0.203: J4.1 4.5,24.5 arc-90 3,23 2.17,23 arc-90 U5.1P
SCK_3V
  Top 0.203: U6.35 21.75,17.25 19.5,15 18.37,15 U5.12P
SCK_5V  (via drill 0.51)
  Top 0.203: U1.9 34.52,15.06 32.33,17.25 32,17.25 | 32,17.25 U6.14 | v32,17 32,17.25 | J2.3 31.55,35.52 31.55,33.7 32.26,33 32.26,22.32 32.76,21.82 32.76,21.18 32,20.42 v32,19
  Bottom 0.203: v32,17 v32,19
SHIFTER_EN  (via drill 0.51)
  Top 0.203: R12.2 22.85,4.3 R13.2 22.85,10.73 U6.48 23.75,10.75 24.5,11.5 v24.5,12.5 | U6.25 23.75,22.25 24.5,21.5 v24.5,20
  Bottom 0.203: v24.5,20 23.84,19.34 23.84,13.16 v24.5,12.5
SS_3V
  Top 0.203: U6.33 21.33,18.25 21.32,18.26 20.68,18.26 19.44,17.02 U5.13P 17.48,17.02 16.5,18 16.5,19 17.5,20 19.5,20 20,20.5 20,23.85 R6.1
SS_5V
  Top 0.203: U1.8 34.79,15.86 32.4,18.25 32.33,18.25 32.32,18.24 31.68,18.24 31.67,18.25 U6.16
UCAP  (via drill 0.51)
  Top 0.203: U1.6 37.46,17.46 v37.5,17.5
  Bottom 0.203: C4.1 v37.49,17.49 v37.5,17.5
XTAL1
  Top 0.305: U1.17 41.66,9.49 41.79,9.36 41.79,9.11 X1.1 44.52,8.43 C8.1
XTAL2
  Top 0.305: C10.1 40.27,4.48 X1.3 40.94,7.5 41.11,7.5 41.3,7.69 41.3,9.16 40.86,9.61 U1.16

### Text on the board
tPlace: 5V | 5V | 5V OK | 3.3V OK | E-Stop V1.3 / RoboRacing 2019 | Bridge to use / POGO